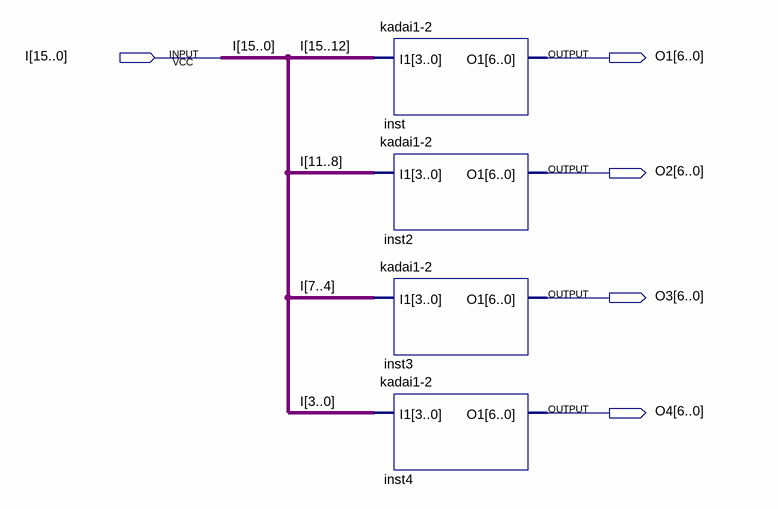
[diagram p0: schematic sheet]
// Quartus schematic shower.bdf as structural Verilog: 4 symbols, 5 pins
module shower (
  input  [15:0] I,
  output [6:0] O1,
  output [6:0] O2,
  output [6:0] O3,
  output [6:0] O4
);

  \kadai1-2  inst (.I1(I[15:12]), .O1(O1));
  \kadai1-2  inst2 (.I1(I[11:8]), .O1(O2));
  \kadai1-2  inst3 (.I1(I[7:4]), .O1(O3));
  \kadai1-2  inst4 (.I1(I[3:0]), .O1(O4));
endmodule
